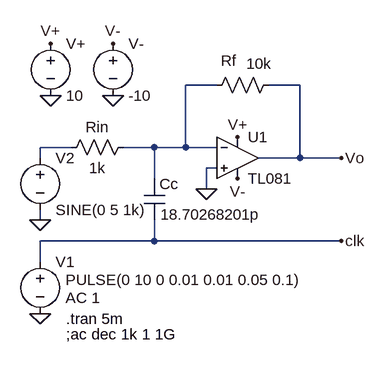
[diagram p0: schematic Lab 2 Experiment 4.asc]
Lab 2 Experiment 4.asc, the LTspice schematic file:
Version 4
SHEET 1 880 680
WIRE 160 48 112 48
WIRE 288 48 240 48
WIRE -64 144 -112 144
WIRE 64 144 16 144
WIRE 112 144 112 48
WIRE 112 144 64 144
WIRE 160 144 112 144
WIRE -112 160 -112 144
WIRE 288 160 288 48
WIRE 288 160 224 160
WIRE 352 160 288 160
WIRE 160 176 144 176
WIRE 64 192 64 144
WIRE 144 208 144 176
WIRE -112 256 -112 240
WIRE 64 288 64 256
WIRE 64 288 -112 288
WIRE 352 288 64 288
WIRE -112 320 -112 288
FLAG -112 256 0
FLAG 144 208 0
FLAG 352 160 Vo
FLAG 192 128 V+
FLAG 192 192 V-
FLAG 0 64 0
FLAG -96 64 0
FLAG -96 -16 V+
FLAG 0 -16 V-
FLAG -112 400 0
FLAG 352 288 clk
SYMBOL AutoGenerated\\TL081 192 96 R0
SYMATTR InstName U1
SYMBOL voltage -96 -32 R0
WINDOW 123 0 0 Left 0
WINDOW 39 0 0 Left 0
SYMATTR InstName V+
SYMATTR Value 10
SYMBOL res 32 128 R90
WINDOW 0 0 56 VBottom 2
WINDOW 3 32 56 VTop 2
SYMATTR InstName Rin
SYMATTR Value 1k
SYMBOL res 256 32 R90
WINDOW 0 -6 78 VBottom 2
WINDOW 3 -33 31 VTop 2
SYMATTR InstName Rf
SYMATTR Value 10k
SYMBOL voltage -112 304 R0
WINDOW 3 39 44 Left 2
WINDOW 123 39 72 Left 2
WINDOW 39 0 0 Left 0
SYMATTR Value PULSE(0 10 0 0.01 0.01 0.05 0.1)
SYMATTR Value2 AC 1
SYMATTR InstName V1
SYMBOL cap 48 192 R0
WINDOW 3 25 55 Left 2
SYMATTR Value 18.70268201p
SYMATTR InstName Cc
SYMBOL voltage 0 -32 R0
WINDOW 123 0 0 Left 0
WINDOW 39 0 0 Left 0
SYMATTR InstName V-
SYMATTR Value -10
SYMBOL voltage -112 144 R0
WINDOW 123 0 0 Left 0
WINDOW 39 0 0 Left 0
SYMATTR InstName V2
SYMATTR Value SINE(0 5 1k)
TEXT -72 408 Left 2 !.tran 5m
TEXT -72 432 Left 2 !;ac dec 1k 1 1G

The netlist it stands for:
* Lab 2 Experiment 4.asc
* U1: TL081 (symbol AutoGenerated\TL081 not available, pins judged from their places): In+=0 In-=N001 V+=V+ V-=V- OUT=Vo
V+ V+ 0 10
Rin N001 N002 1k
Rf Vo N001 10k
V1 clk 0 PULSE(0 10 0 0.01 0.01 0.05 0.1) AC 1
Cc N001 clk 18.70268201p
V- V- 0 -10
V2 N002 0 SINE(0 5 1k)
.tran 5m
;ac dec 1k 1 1G
.backanno
.end